# EAGLE design design (EAGLE 9.5.2)
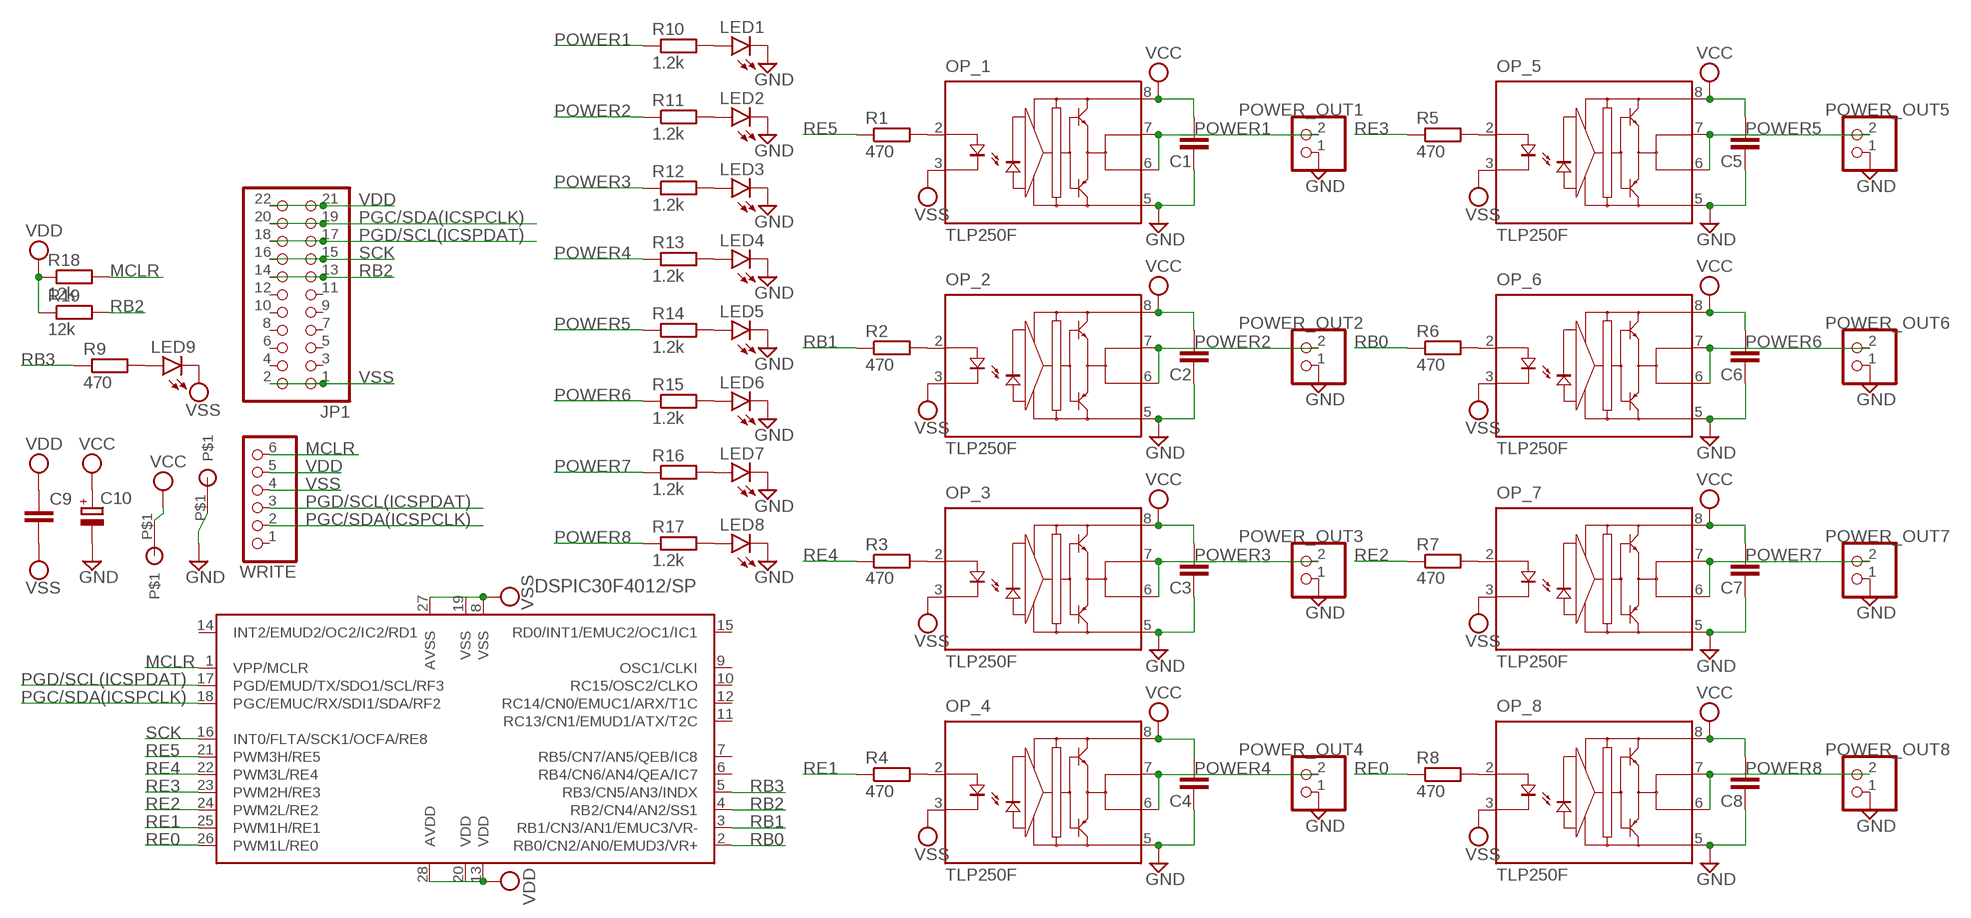
[diagram p0: schematic, sheet 1]

## Parts
C1  C-EUC2012  [C2012]
C2  C-EUC2012  [C2012]
C3  C-EUC2012  [C2012]
C4  C-EUC2012  [C2012]
C5  C-EUC2012  [C2012]
C6  C-EUC2012  [C2012]
C7  C-EUC2012  [C2012]
C8  C-EUC2012  [C2012]
C9  C-EUC2012  [C2012]
C10  CPOL-EUE5-13  [E5-13]
IC1  DSPIC30F4012/SP  [DIL28-3]
JP1  PINHD-2X11/90  [2X11/90]
LED1  LEDCHIPLED_0603  [CHIPLED_0603]
LED2  LEDCHIPLED_0603  [CHIPLED_0603]
LED3  LEDCHIPLED_0603  [CHIPLED_0603]
LED4  LEDCHIPLED_0603  [CHIPLED_0603]
LED5  LEDCHIPLED_0603  [CHIPLED_0603]
LED6  LEDCHIPLED_0603  [CHIPLED_0603]
LED7  LEDCHIPLED_0603  [CHIPLED_0603]
LED8  LEDCHIPLED_0603  [CHIPLED_0603]
LED9  LEDCHIPLED_0603  [CHIPLED_0603]
OP_1  TLP250F  [DIL08]
OP_2  TLP250F  [DIL08]
OP_3  TLP250F  [DIL08]
OP_4  TLP250F  [DIL08]
OP_5  TLP250F  [DIL08]
OP_6  TLP250F  [DIL08]
OP_7  TLP250F  [DIL08]
OP_8  TLP250F  [DIL08]
POWER_OUT1  PINHD-1X2/90  [1X02/90]
POWER_OUT2  PINHD-1X2/90  [1X02/90]
POWER_OUT3  PINHD-1X2/90  [1X02/90]
POWER_OUT4  PINHD-1X2/90  [1X02/90]
POWER_OUT5  PINHD-1X2/90  [1X02/90]
POWER_OUT6  PINHD-1X2/90  [1X02/90]
POWER_OUT7  PINHD-1X2/90  [1X02/90]
POWER_OUT8  PINHD-1X2/90  [1X02/90]
R1  470  R-EU_M0805  [M0805]
R2  470  R-EU_M0805  [M0805]
R3  470  R-EU_M0805  [M0805]
R4  470  R-EU_M0805  [M0805]
R5  470  R-EU_M0805  [M0805]
R6  470  R-EU_M0805  [M0805]
R7  470  R-EU_M0805  [M0805]
R8  470  R-EU_M0805  [M0805]
R9  470  R-EU_M0805  [M0805]
R10  1.2k  R-EU_M0805  [M0805]
R11  1.2k  R-EU_M0805  [M0805]
R12  1.2k  R-EU_M0805  [M0805]
R13  1.2k  R-EU_M0805  [M0805]
R14  1.2k  R-EU_M0805  [M0805]
R15  1.2k  R-EU_M0805  [M0805]
R16  1.2k  R-EU_M0805  [M0805]
R17  1.2k  R-EU_M0805  [M0805]
R18  12k  R-EU_M0805  [M0805]
R19  12k  R-EU_M0805  [M0805]
U$1  MARU  [MARU]
U$8  MARU  [MARU]
WRITE  PINHD-1X6/90  [1X06/90]

## Nets
GND: C1.2 C2.2 C3.2 C4.2 C5.2 C6.2 C7.2 C8.2 C10.- LED1.C LED2.C LED3.C LED4.C LED5.C LED6.C LED7.C LED8.C OP_1.5(GND) OP_2.5(GND) OP_3.5(GND) OP_4.5(GND) OP_5.5(GND) OP_6.5(GND) OP_7.5(GND) OP_8.5(GND) POWER_OUT1.1 POWER_OUT2.1 POWER_OUT3.1 POWER_OUT4.1 POWER_OUT5.1 POWER_OUT6.1 POWER_OUT7.1 POWER_OUT8.1 U$1.P$1
MCLR: IC1.1(VPP/MCLR) R18.2 WRITE.6
N$1: OP_1.2(A) R1.2
N$2: OP_2.2(A) R2.2
N$3: OP_3.2(A) R3.2
N$4: OP_4.2(A) R4.2
N$6: OP_5.2(A) R5.2
N$8: OP_6.2(A) R6.2
N$10: OP_7.2(A) R7.2
N$12: OP_8.2(A) R8.2
N$13: LED9.A R9.2
N$14: LED1.A R10.2
N$15: LED2.A R11.2
N$16: LED3.A R12.2
N$17: LED4.A R13.2
N$18: LED5.A R14.2
N$19: LED6.A R15.2
N$20: LED8.A R17.2
N$21: LED7.A R16.2
PGC/SDA(ICSPCLK): IC1.18(PGC/EMUC/RX/SDI1/SDA/RF2) JP1.19 JP1.20 WRITE.2
PGD/SCL(ICSPDAT): IC1.17(PGD/EMUD/TX/SDO1/SCL/RF3) JP1.17 JP1.18 WRITE.3
POWER1: OP_1.6(VO) OP_1.7(VO') POWER_OUT1.2 R10.1
POWER2: OP_2.6(VO) OP_2.7(VO') POWER_OUT2.2 R11.1
POWER3: OP_3.6(VO) OP_3.7(VO') POWER_OUT3.2 R12.1
POWER4: OP_4.6(VO) OP_4.7(VO') POWER_OUT4.2 R13.1
POWER5: OP_5.6(VO) OP_5.7(VO') POWER_OUT5.2 R14.1
POWER6: OP_6.6(VO) OP_6.7(VO') POWER_OUT6.2 R15.1
POWER7: OP_7.6(VO) OP_7.7(VO') POWER_OUT7.2 R16.1
POWER8: OP_8.6(VO) OP_8.7(VO') POWER_OUT8.2 R17.1
RB0: IC1.2(RB0/CN2/AN0/EMUD3/VR+) R6.1
RB1: IC1.3(RB1/CN3/AN1/EMUC3/VR-) R2.1
RB2: IC1.4(RB2/CN4/AN2/SS1) JP1.13 JP1.14 R19.2
RB3: IC1.5(RB3/CN5/AN3/INDX) R9.1
RE0: IC1.26(PWM1L/RE0) R8.1
RE1: IC1.25(PWM1H/RE1) R4.1
RE2: IC1.24(PWM2L/RE2) R7.1
RE3: IC1.23(PWM2H/RE3) R5.1
RE4: IC1.22(PWM3L/RE4) R3.1
RE5: IC1.21(PWM3H/RE5) R1.1
SCK: IC1.16(INT0/FLTA/SCK1/OCFA/RE8) JP1.15 JP1.16
VCC: C1.1 C2.1 C3.1 C4.1 C5.1 C6.1 C7.1 C8.1 C10.+ OP_1.8(VCC) OP_2.8(VCC) OP_3.8(VCC) OP_4.8(VCC) OP_5.8(VCC) OP_6.8(VCC) OP_7.8(VCC) OP_8.8(VCC) U$8.P$1
VDD: C9.1 IC1.13(VDD) IC1.20(VDD) IC1.28(AVDD) JP1.21 JP1.22 R18.1 R19.1 WRITE.5
VSS: C9.2 IC1.8(VSS) IC1.19(VSS) IC1.27(AVSS) JP1.1 JP1.2 LED9.C OP_1.3(K) OP_2.3(K) OP_3.3(K) OP_4.3(K) OP_5.3(K) OP_6.3(K) OP_7.3(K) OP_8.3(K) WRITE.4
Unconnected: IC1.6(RB4/CN6/AN4/QEA/IC7) IC1.7(RB5/CN7/AN5/QEB/IC8) IC1.9(OSC1/CLKI) IC1.10(RC15/OSC2/CLKO) IC1.11(RC13/CN1/EMUD1/ATX/T2C) IC1.12(RC14/CN0/EMUC1/ARX/T1C) IC1.14(INT2/EMUD2/OC2/IC2/RD1) IC1.15(RD0/INT1/EMUC2/OC1/IC1) JP1.3 JP1.4 JP1.5 JP1.6 JP1.7 JP1.8 JP1.9 JP1.10 JP1.11 JP1.12 WRITE.1

## Library data of the parts
C1-C9 = rcl:C-EU: CAPACITOR, European symbol; SPICEPREFIX: C
C10 = rcl:CPOL-EU: POLARIZED CAPACITOR, European symbol; SPICEPREFIX: C
IC1 = microchip-dspic:DSPIC30F4012: dsPIC Motion Controller DSC
JP1 = pinhead:PINHD-2X11: PIN HEADER
LED1-LED9 = led:LED: LED OSRAM: - CHIPLED LG R971, LG N971, LY N971, LG Q971, LY Q971, LO R971, LY R971 LH N974, LH R974 LS Q976, LO Q976, LY Q976 LO Q996 - Hyper CHIPLED LW Q18S LB Q993, LB Q99A, LB R99A - SideLED LS A670, LO A670, LY A670, LG A670, LP A670 LB A673, LV A673, LT A673, LW A673 LH A674 LY A675 LS A676, LA A676, LO A676, LY A676, LW A676 LS A679, LY A679, LG A679 - Hyper Micro SIDELED® LS Y876, LA Y876, LO Y876, LY Y876 LT Y87S - SmartLED LW L88C, LW L88S LB L89C, LB L89S, LG L890 LS L89K, LO L89K, LY L89K LS L896, LA L896, LO L896, LY L896 - TOPLED LS T670, LO T670, LY T670, LG T670, LP T670 LSG T670, LSP T670, LSY T670, LOP T670, LYG T670 LG T671, LOG T671, LSG T671 LB T673, LV T673, LT T673, LW T673 LH T674 LS T676, LA T676, LO T676, LY T676, LB T676, LH T676, LSB T676, LW T676 LB T67C, LV T67C, LT T67C, LS T67K, LO T67K, LY T67K, LW E67C LS E67B, LA E67B, LO E67B, LY E67B, LB E67C, LV E67C, LT E67C LW T67C LS T679, LY T679, LG T679 LS T770, LO T770, LY T770, LG T770, LP T770 LB T773, LV T773, LT T773, LW T773 LH T774 LS E675, LA E675, LY E675, LS T675 LS T776, LA T776, LO T776, LY T776, LB T776 LHGB T686 LT T68C, LB T68C - Hyper Mini TOPLED® LB M676 - Mini TOPLED Santana® LG M470 LS M47K, LO M47K, LY M47K Source: http://www.osram.convergy.de LUXEON: - LUMILED® LXK2-PW12-R00, LXK2-PW12-S00, LXK2-PW14-U00, LXK2-PW14-V00 LXK2-PM12-R00, LXK2-PM12-S00, LXK2-PM14-U00 LXK2-PE12-Q00, LXK2-PE12-R00, LXK2-PE12-S00, LXK2-PE14-T00, LXK2-PE14-U00 LXK2-PB12-K00, LXK2-PB12-L00, LXK2-PB12-M00, LXK2-PB14-N00, LXK2-PB14-P00, LXK2-PB14-Q00 LXK2-PR12-L00, LXK2-PR12-M00, LXK2-PR14-Q00, LXK2-PR14-R00 LXK2-PD12-Q00, LXK2-PD12-R00, LXK2-PD12-S00 LXK2-PH12-R00, LXK2-PH12-S00 LXK2-PL12-P00, LXK2-PL12-Q00, LXK2-PL12-R00 Source: www.luxeon.com KINGBRIGHT: KA-3528ASYC Source: www.kingbright.com
OP_1-OP_8 = optocoupler-3-jcn:TLP250F: Toshiba Transistor Inverter Inverter For Air Conditionor IGBT Gate Drive Power MOS FET Gate Drive
POWER_OUT1-POWER_OUT8 = pinhead:PINHD-1X2: PIN HEADER
R1-R19 = rcl:R-EU_: RESISTOR, European symbol; SPICEPREFIX: R
U$1 U$8 = abouters_hira:MARU
WRITE = pinhead:PINHD-1X6: PIN HEADER

## Board
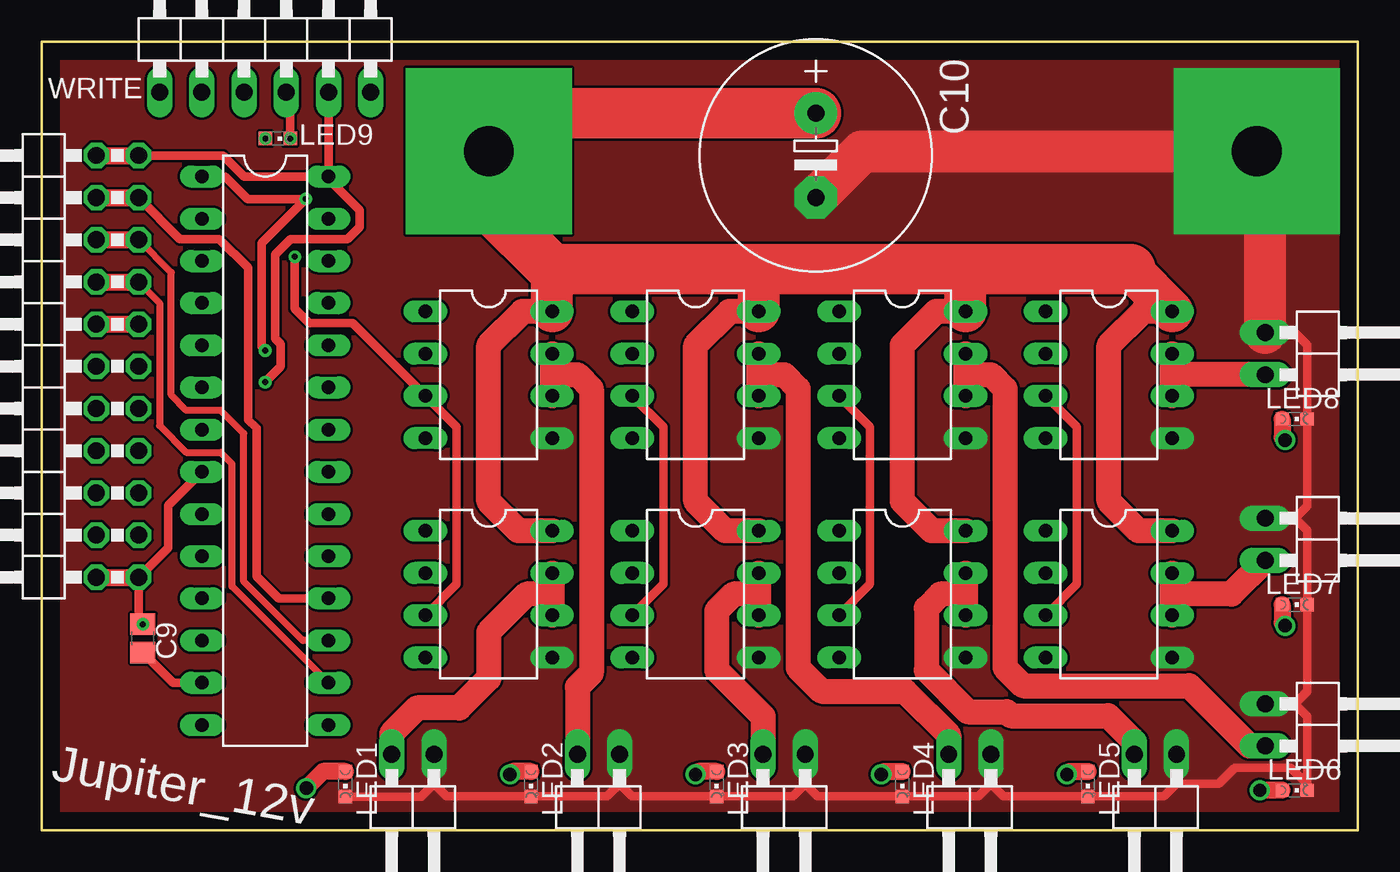
[diagram p1: board, top side]
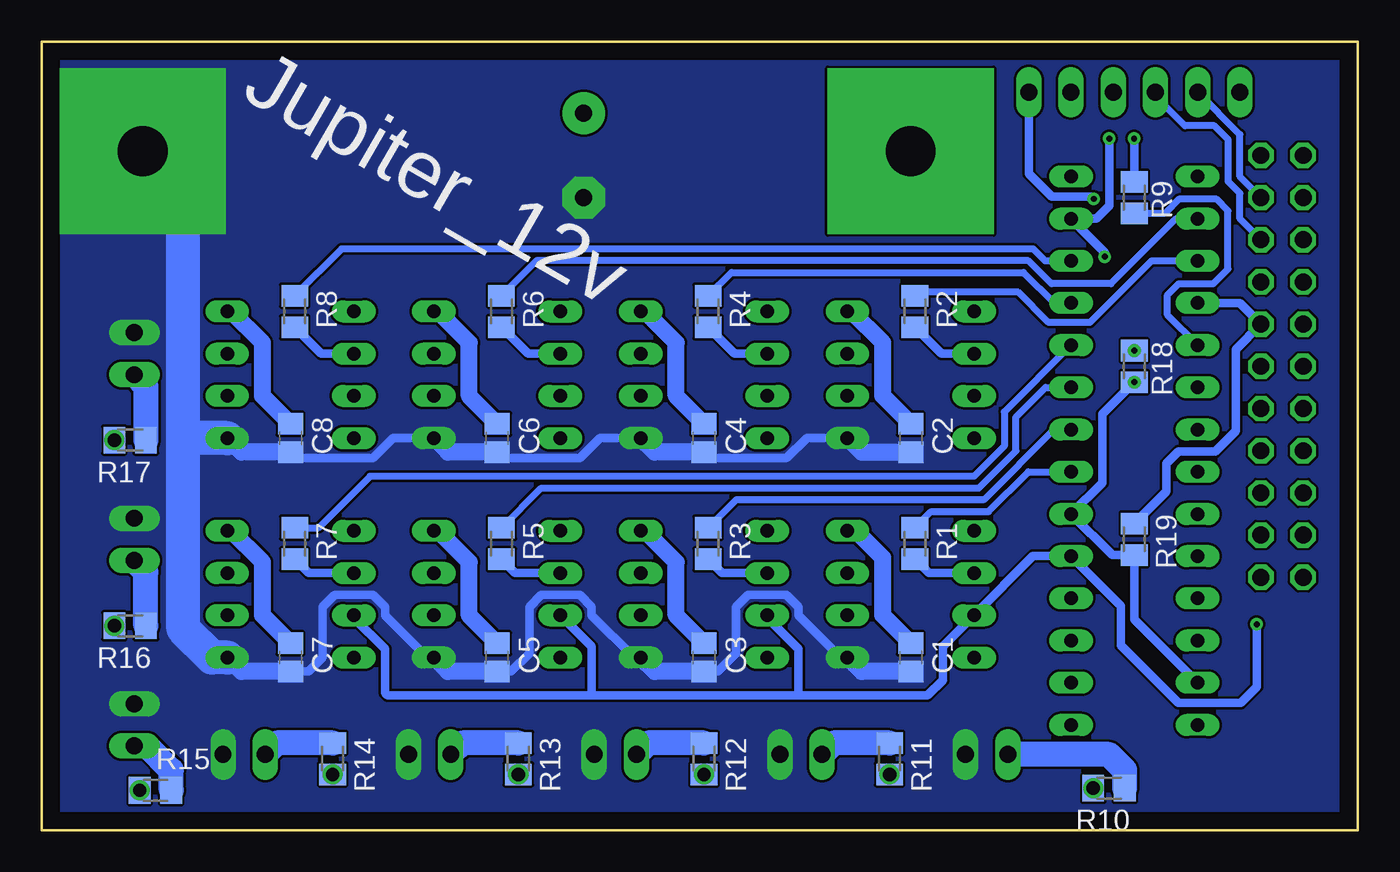
[diagram p2: board, bottom side, seen from below]

Size 79.25 x 47.5 mm. Coordinates in mm from the lower left corner, seen from the top.
Outline: 0,47.5 0,0 79.25,0 79.25,47.5 0,47.5
Copper layers (1*16): Top 0.035mm / dielectric 1.5mm / Bottom 0.035mm
Design rules "default *": minimum track width 6mil, minimum drill 0.35mm, track to track 6mil, track to pad 6mil, pad to pad 6mil, via to via 6mil, smd to smd 6mil, copper to edge 40mil, drill to drill 6mil, minimum pad ring 10mil, minimum via ring 8mil, stop-mask expansion 4mil, vias tented up to drill 0mil, thermal gap 10mil

### Footprints (pad centres in the part's own frame; a part is rotated, then mirrored left to right if it is on the bottom)
C2012 = smd 1.3 x 1.5: 1 -0.85,0; 2 0.85,0
E5-13 = drill 1.016 pad 2.54: + -2.54,0 | drill 1.016 pad 2.54 octagon: - 2.54,0
DIL28-3 = drill 0.813 long: 1 -16.51,-3.81; 2 -13.97,-3.81; 3 -11.43,-3.81; 4 -8.89,-3.81; 5 -6.35,-3.81; 6 -3.81,-3.81; 7 -1.27,-3.81; 8 1.27,-3.81; 9 3.81,-3.81; 10 6.35,-3.81; 11 8.89,-3.81; 12 11.43,-3.81; 13 13.97,-3.81; 14 16.51,-3.81; 15 16.51,3.81; 16 13.97,3.81; 17 11.43,3.81; 18 8.89,3.81; 19 6.35,3.81; 20 3.81,3.81; 21 1.27,3.81; 22 -1.27,3.81; 23 -3.81,3.81; 24 -6.35,3.81; 25 -8.89,3.81; 26 -11.43,3.81; 27 -13.97,3.81; 28 -16.51,3.81
2X11/90 = drill 1.016 octagon: 1 -12.7,-6.35; 2 -12.7,-3.81; 3 -10.16,-6.35; 4 -10.16,-3.81; 5 -7.62,-6.35; 6 -7.62,-3.81; 7 -5.08,-6.35; 8 -5.08,-3.81; 9 -2.54,-6.35; 10 -2.54,-3.81; 11 0,-6.35; 12 0,-3.81; 13 2.54,-6.35; 14 2.54,-3.81; 15 5.08,-6.35; 16 5.08,-3.81; 17 7.62,-6.35; 18 7.62,-3.81; 19 10.16,-6.35; 20 10.16,-3.81; 21 12.7,-6.35; 22 12.7,-3.81
CHIPLED_0603 = smd 0.8 x 0.8: A 0,-0.75; C 0,0.75
DIL08 = drill 0.813 long: 1 -3.81,-3.81; 2 -1.27,-3.81; 3 1.27,-3.81; 4 3.81,-3.81; 5 3.81,3.81; 6 1.27,3.81; 7 -1.27,3.81; 8 -3.81,3.81
1X02/90 = drill 1.016 long: 1 -1.27,-3.81; 2 1.27,-3.81
M0805 = smd 1.3 x 1.6: 1 -0.95,0; 2 0.95,0
MARU = drill 3 pad 10 square: P$1 0,0
1X06/90 = drill 1.016 long: 1 -6.35,-3.81; 2 -3.81,-3.81; 3 -1.27,-3.81; 4 1.27,-3.81; 5 3.81,-3.81; 6 6.35,-3.81

### Placement (x,y rotation side)
C1  26.92,10.41 270 bottom
C2  26.92,23.62 270 bottom
C3  39.37,10.41 270 bottom
C4  39.37,23.62 270 bottom
C5  51.82,10.41 270 bottom
C6  51.82,23.62 270 bottom
C7  64.26,10.41 270 bottom
C8  64.26,23.62 270 bottom
C9  6.1,11.56 90 top
C10  46.61,40.64 270 top
IC1  13.46,22.86 270 top
JP1  -0.51,27.94 90 top
LED1  18.29,2.79 180 top
LED2  29.46,2.79 180 top
LED3  40.64,2.79 180 top
LED4  51.82,2.79 180 top
LED5  62.99,2.79 180 top
LED6  75.44,2.41 270 top
LED7  75.44,13.59 270 top
LED8  75.44,24.77 270 top
LED9  14.22,41.66 270 top
OP_1  26.92,14.22 270 top
OP_2  26.92,27.43 270 top
OP_3  39.37,14.22 270 top
OP_4  39.37,27.43 270 top
OP_5  51.82,14.22 270 top
OP_6  51.82,27.43 270 top
OP_7  64.26,14.22 270 top
OP_8  64.26,27.43 270 top
POWER_OUT1  22.35,0.76 180 top
POWER_OUT2  33.53,0.76 180 top
POWER_OUT3  44.7,0.76 180 top
POWER_OUT4  55.88,0.76 180 top
POWER_OUT5  67.06,0.76 180 top
POWER_OUT6  77.47,6.35 270 top
POWER_OUT7  77.47,17.53 270 top
POWER_OUT8  77.47,28.7 270 top
R1  26.67,17.27 270 bottom
R2  26.67,31.24 270 bottom
R3  39.12,17.27 270 bottom
R4  39.12,31.24 270 bottom
R5  51.56,17.27 270 bottom
R6  51.56,31.24 270 bottom
R7  64.01,17.27 270 bottom
R8  64.01,31.24 270 bottom
R9  13.46,38.1 90 bottom
R10  14.99,2.54 180 bottom
R11  28.19,4.32 270 bottom
R12  39.37,4.32 270 bottom
R13  50.55,4.32 270 bottom
R14  61.72,4.32 270 bottom
R15  72.39,2.41 180 bottom
R16  73.91,12.32 180 bottom
R17  73.91,23.5 180 bottom
R18  13.46,27.94 90 bottom
R19  13.46,17.53 90 bottom
U$1  73.15,40.89 0 top
U$8  26.92,40.89 0 top
WRITE  13.46,48.26 0 top

### Tracks (layer width: path | path; a pad name or v marks a point on that pad's centre or on a via)
GND
  Top 0.508: POWER_OUT1.1 23.62,2.79 | 23.62,2.79 22.86,2.03 18.3,2.03 LED1.C | 23.62,2.79 24.37,2.04 LED2.C 34.05,2.04 34.8,2.79 | POWER_OUT2.1 34.8,2.79 | 34.8,2.79 35.55,2.04 LED3.C 45.22,2.04 45.97,2.79 | POWER_OUT3.1 45.97,2.79 | 45.97,2.79 46.72,2.04 LED4.C 56.4,2.04 57.15,2.79 | POWER_OUT4.1 57.15,2.79 | POWER_OUT5.1 68.33,2.79 | POWER_OUT6.1 75.44,7.62 | 75.44,18.8 POWER_OUT7.1 | POWER_OUT8.1 75.44,29.97 76.19,29.22 LED8.C 76.19,19.55 75.44,18.8 | 57.15,2.79 57.9,2.04 LED5.C 67.58,2.04 68.33,2.79 | 75.44,7.62 76.19,6.87 76.19,2.79 | 76.19,2.79 LED6.C | 68.33,2.79 70.87,2.79 71.84,3.76 75.22,3.76 76.19,2.79 | 75.44,7.62 76.19,8.37 LED7.C 76.19,18.05 75.44,18.8
  Top 2.54: C10.- 49.4,40.89 U$1.P$1 73.66,40.39 POWER_OUT8.1
  Bottom 0.508: OP_6.5 58.07,23.62 59.29,22.41 63.9,22.41 C8.2 | OP_4.5 45.63,23.62 46.84,22.41 51.45,22.41 C6.2 | OP_2.5 33.18,23.62 34.4,22.41 39.01,22.41 C4.2 | OP_1.5 31.15,10.41 33.69,12.95 33.69,13.46 34.4,14.17 36.72,14.17 37.44,13.46 37.44,10.67 38.54,9.56 C3.2 | OP_3.5 43.59,10.41 46.13,12.95 46.13,13.46 46.84,14.17 49.17,14.17 49.88,13.46 49.88,10.67 50.98,9.56 C5.2 | OP_5.5 56.04,10.41 58.58,12.95 58.58,13.46 59.29,14.17 61.61,14.17 62.33,13.46 62.33,10.41 63.18,9.56 C7.2
  Bottom 1.016: OP_2.5 29.88,22.77 C2.2 | C4.2 42.33,22.77 OP_4.5 | C6.2 54.78,22.77 OP_6.5 | C8.2 67.22,22.77 OP_8.5 | C7.2 67.22,9.56 OP_7.5 | C5.2 54.78,9.56 OP_5.5 | C1.2 29.88,9.56 OP_1.5 | C3.2 42.33,9.56 OP_3.5
  Bottom 2.032: U$1.P$1 70.71,38.45 70.71,23.62 | OP_7.5 68.99,10.41 70.71,12.14 70.71,23.62 | OP_8.5 70.71,23.62
  pour Bottom (no thermals): 0,47.5 0,0 79.25,0 79.25,47.5
  pour Top (no thermals): 0,47.5 0,0 79.25,0 79.25,47.5
MCLR  (via drill 0.35)
  Top 0.508: IC1.1 11.05,39.37 12.4,38.02 v15.91,38.02 13.25,35.36 13.25,29.11 R18.2
  Bottom 0.508: v15.91,38.02 16.04,38.16 18.44,38.16 19.81,39.53 WRITE.6
  other vias: 13.46,28.89
N$1
  Bottom 0.508: OP_1.2 25.84,15.49 R1.2
N$2
  Bottom 0.508: OP_2.2 25.08,28.7 R2.2
N$3
  Bottom 0.508: OP_3.2 38.29,15.49 R3.2
N$4
  Bottom 0.508: OP_4.2 37.53,28.7 R4.2
N$6
  Bottom 0.508: OP_5.2 50.73,15.49 R5.2
N$8
  Bottom 0.508: R6.2 49.97,28.7 OP_6.2
N$10
  Bottom 0.508: OP_7.2 63.18,15.49 R7.2
N$12
  Bottom 0.508: R8.2 62.42,28.7 OP_8.2
N$13  (via drill 0.35)
  Bottom 0.508: R9.2 13.46,41.64 LED9.A
  other vias: 13.47,41.66
N$14  (via drill 0.8)
  Top 1.016: LED1.A 16.94,3.54 R10.2
  other vias: 15.94,2.54
N$15  (via drill 0.8)
  Top 1.016: LED2.A 28.37,3.54 R11.2
  other vias: 28.19,3.37
N$16  (via drill 0.8)
  Top 1.016: LED3.A 39.55,3.54 R12.2
  other vias: 39.37,3.37
N$17  (via drill 0.8)
  Top 1.016: R13.2 50.72,3.54 LED4.A
  other vias: 50.55,3.37
N$18  (via drill 0.8)
  Top 1.016: R14.2 61.9,3.54 LED5.A
  other vias: 61.72,3.37
N$19  (via drill 0.8)
  Top 1.016: LED6.A R15.2
  other vias: 73.34,2.41
N$20  (via drill 0.8)
  Top 1.016: LED8.A 74.69,23.67 R17.2
  other vias: 74.86,23.5
N$21  (via drill 0.8)
  Top 1.016: LED7.A 74.69,12.5 R16.2
  other vias: 74.86,12.32
PGC/SDA(ICSPCLK)
  Top 0.508: JP1.19 8.33,35.62 10.7,35.62 12.44,33.88 12.44,24.72 12.94,24.22 12.94,15.29 14.26,13.97 IC1.18
  Top 1.016: JP1.20 JP1.19
  Bottom 0.406: JP1.19 7.11,39.37 7.11,41.89 9.65,44.44 WRITE.2
PGD/SCL(ICSPDAT)
  Top 0.406: IC1.17 15.73,11.43 12.18,14.98 12.18,23.91 10.79,25.29 8.72,25.29 7.81,26.2 7.81,33.59 JP1.17
  Top 1.016: JP1.18 JP1.17
  Bottom 0.406: JP1.17 7.11,36.83 7.11,38.37 7.81,39.07 7.81,41.6 8.64,42.42 10.42,42.42 12.19,44.2 WRITE.3
POWER1
  Top 1.5: OP_1.7 30.73,14.22 | 30.73,14.22 OP_1.6 | 30.73,14.22 29.21,14.22 26.92,11.94 26.92,9.14 25.15,7.37 22.61,7.37 21.08,5.84 POWER_OUT1.2
  Bottom 1.5: R10.1 14.04,3.62 14.99,4.57 POWER_OUT1.2
POWER2
  Top 1.5: OP_2.7 30.73,27.43 | 30.73,27.43 OP_2.6 | POWER_OUT2.2 32.26,8.64 33.11,9.48 33.11,26.59 32.26,27.43 30.73,27.43
  Bottom 1.5: R11.1 31.56,5.27 POWER_OUT2.2
POWER3
  Top 1.5: OP_3.6 43.18,14.22 | 43.18,14.22 OP_3.7 | 43.18,14.22 41.66,14.22 40.64,13.21 40.64,9.65 43.43,6.86 POWER_OUT3.2
  Bottom 1.5: R12.1 42.74,5.27 POWER_OUT3.2
POWER4
  Top 1.5: OP_4.6 43.18,27.43 | 43.18,27.43 OP_4.7 | 43.18,27.43 44.7,27.43 45.55,26.59 45.55,9.79 46.96,8.38 51.98,8.38 54.61,5.75 POWER_OUT4.2
  Bottom 1.5: R13.1 53.91,5.27 POWER_OUT4.2
POWER5
  Top 1.5: OP_5.7 55.63,14.22 | 55.63,14.22 OP_5.6 | 55.63,14.22 54.1,14.22 53.26,13.38 53.26,9.65 55.76,7.15 58.09,7.15 58.34,6.9 64.22,6.9 65.79,5.33 POWER_OUT5.2
  Bottom 1.5: R14.1 65.09,5.27 POWER_OUT5.2
POWER6
  Top 1.5: OP_6.7 55.63,27.43 | 55.63,27.43 OP_6.6 | 55.63,27.43 57.15,27.43 58,26.59 58,9.79 59.08,8.7 69.09,8.7 72.71,5.08 POWER_OUT6.2
  Bottom 1.5: R15.1 71.44,3.62 72.9,5.08 POWER_OUT6.2
POWER7
  Top 1.5: OP_7.6 68.07,14.22 | 68.07,14.22 OP_7.7 | POWER_OUT7.2 71.63,14.22 68.07,14.22
  Bottom 1.5: R16.1 72.96,15.56 POWER_OUT7.2
POWER8
  Top 1.5: OP_8.6 68.07,27.43 | 68.07,27.43 OP_8.7 | POWER_OUT8.2 68.07,27.43
  Bottom 1.5: POWER_OUT8.2 72.96,26.74 R17.1
RB0
  Bottom 0.406: IC1.2 10.96,36.83 14.88,32.91 18.45,32.91 19.84,34.31 49.45,34.31 R6.1
RB1
  Bottom 0.406: IC1.3 12.43,34.29 16.13,30.59 18.63,30.59 20.45,32.41 26.46,32.41 R2.1
RB2
  Top 1.016: JP1.14 JP1.13
  Bottom 0.508: IC1.4 7.11,31.75 JP1.13 7.37,28.96 7.37,24.04 8.6,22.8 10.82,22.8 11.53,22.09 11.53,20.41 R19.2
RB3
  Bottom 0.406: IC1.5 11.48,31.03 11.48,32.23 10.79,32.91 8.72,32.91 7.83,33.81 7.83,37.31 8.51,37.99 10.79,37.99 11.64,37.15 R9.1
RE0
  Bottom 0.406: IC1.26 18.83,34.29 19.55,35.01 61.19,35.01 R8.1
RE1
  Bottom 0.406: IC1.25 18.29,31.75 20.13,33.6 37.71,33.6 R4.1
RE2
  Bottom 0.406: IC1.24 21.29,25.19 21.29,23.14 23.11,21.32 59.47,21.32 62.57,18.22 R7.1
RE3
  Bottom 0.406: R5.1 49.17,20.61 24.64,20.61 22.82,20.61 20.58,22.85 20.58,24.9 18.81,26.67 IC1.23
RE4
  Bottom 0.406: R3.1 37.43,19.9 23.11,19.9 23.02,19.9 22.53,19.9 18.3,24.13 IC1.22
RE5
  Bottom 0.406: R1.1 25.69,19.2 22.23,19.2 19.84,21.59 IC1.21
SCK
  Top 0.406: JP1.15 7.11,31.76 7.11,24.37 8.72,22.75 10.79,22.75 11.48,22.07 11.48,14.69 IC1.16
  Top 1.016: JP1.16 JP1.15
VCC
  Top 1.5: OP_2.8 28.96,31.24 26.92,29.21 26.92,19.81 28.7,18.03 OP_1.8 | OP_4.8 41.4,31.24 39.37,29.21 39.37,19.81 41.15,18.03 OP_3.8 | OP_6.8 53.85,31.24 51.82,29.21 51.82,19.81 53.59,18.03 OP_5.8 | OP_8.8 66.29,31.24 64.26,29.21 64.26,19.81 66.04,18.03 OP_7.8
  Top 2.54: OP_2.8 30.73,33.78 | 65.53,33.78 OP_8.8 | OP_6.8 55.63,33.78 | OP_4.8 43.18,33.78
  Top 3: U$8.P$1 26.92,37.59 30.73,33.78
  Top 3.048: C10.+ 29.21,43.18 U$8.P$1 | 30.73,33.78 43.18,33.78 55.63,33.78 65.53,33.78
  Bottom 1.016: C2.1 28.61,26.15 28.61,29.37 30.48,31.24 OP_2.8 | C4.1 41.05,26.15 41.05,29.37 42.93,31.24 OP_4.8 | C6.1 53.5,26.15 53.5,29.37 55.37,31.24 OP_6.8 | C8.1 65.94,26.15 65.94,29.37 67.82,31.24 OP_8.8 | C1.1 28.61,12.95 28.61,16.41 30.23,18.03 OP_1.8 | C3.1 41.05,12.95 41.05,16.16 42.93,18.03 OP_3.8 | C5.1 53.5,12.95 53.5,16.16 55.37,18.03 OP_5.8 | C7.1 65.94,12.95 65.94,16.16 67.82,18.03 OP_7.8
VDD  (via drill 0.35)
  Top 0.508: WRITE.5 IC1.28 | IC1.13 7.91,8.89 C9.1 | IC1.28 12.19,39.37 10.92,40.64 JP1.21 | IC1.28 17.27,39.21 19.15,37.33 19.15,36.33 18.44,35.62 14.99,35.62 14.05,34.68 14.05,29.62 14.39,29.28 14.39,27.92 R18.1
  Top 1.016: JP1.22 JP1.21
  Bottom 0.508: IC1.13 13.46,12.7 R19.1 14.8,16.58 IC1.20 15.4,20.93 15.4,25.05 R18.1
  other vias: 13.46,26.99
VSS  (via drill 0.35)
  Top 0.508: OP_1.3 24.99,14.83 24.99,24.29 OP_2.3 18.74,30.54 16.11,30.54 15.24,31.4 v15.24,34.54 | OP_4.3 37.44,24.29 37.44,14.83 OP_3.3 | OP_5.3 49.88,14.83 49.88,24.29 OP_6.3 | OP_7.3 62.33,14.83 62.33,24.29 OP_8.3 | WRITE.4 14.97,44.21 LED9.C | IC1.8 7.62,19.56 7.62,17.02 JP1.1 5.84,12.66 C9.2
  Top 1.016: JP1.2 JP1.1
  Bottom 0.508: OP_3.3 35.56,12.79 33.69,10.92 33.69,8.29 33.53,8.13 | 33.53,8.13 25.91,8.13 24.99,9.05 24.99,11.08 OP_1.3 19.56,16.51 IC1.19 14.27,13.51 14.27,11.13 10.82,7.68 7.06,7.68 6.1,8.64 C9.2 | OP_5.3 46.13,11.08 46.13,8.29 45.97,8.13 | 33.53,8.13 45.97,8.13 | OP_7.3 60.45,12.79 58.58,10.92 58.58,8.29 58.42,8.13 45.97,8.13 | LED9.C 14.97,37.6 15.75,36.83 IC1.27 15.24,34.8 v15.24,34.54
  other vias: 14.97,41.66 6.1,12.41

### Text on the board
tNames: Jupiter_12v
bNames: Jupiter_12v